# Altium schematic sheet [4] Sensors.SchDoc: =DocumentName
size A3; Organization: ORGANIZATION; Address1: R. Aprígio Veloso, 882, Universitário; Address2: Campina Grande - PB; Address3: 58429-900; DocumentNumber: 4; Revision: -; SheetNumber: 4; SheetTotal: 9; ENG_DATE: --/--/--; DSN_DATE: --/--/--; CHK_DATE: --/--/--; SCH_SCALE: 1:1
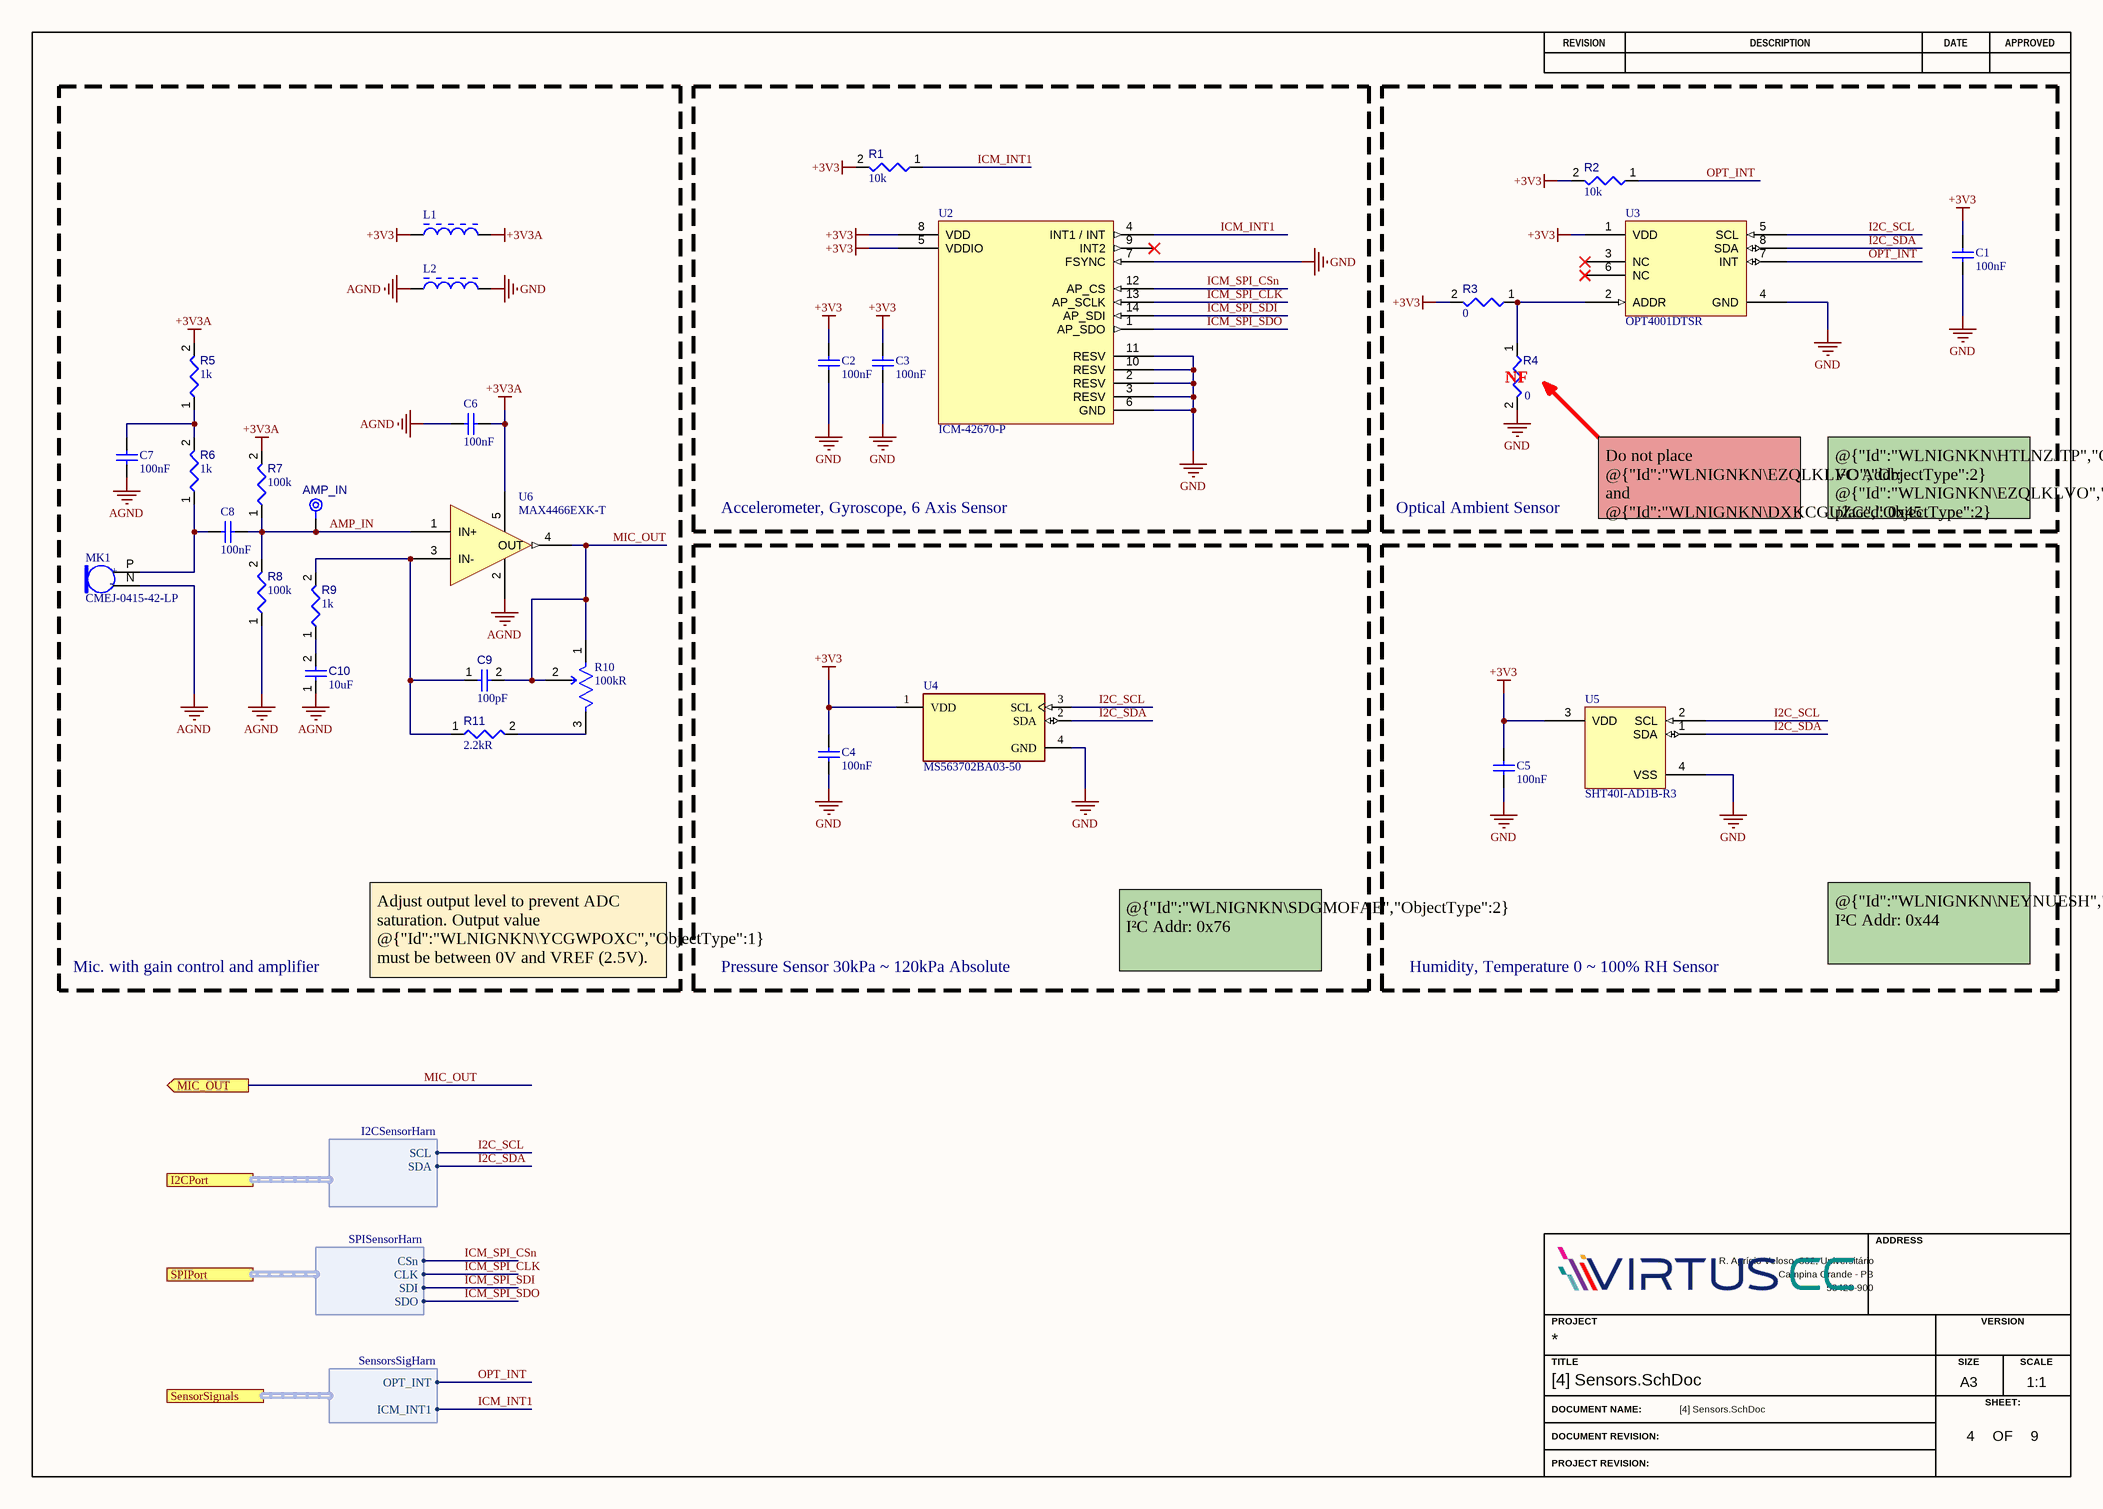
[diagram p0: [4] Sensors.SchDoc]

## Parts
AMP_IN  TPAD6R  [TP06R]  (value not drawn)  (no BOM)
C1  value 100nF  [CAPC0603(1608)100_L]  (hidden comment: VJ0603Y104MXJCW1BC)
C2  value 100nF  [CAPC0603(1608)100_L]  (hidden comment: VJ0603Y104MXJCW1BC)
C3  value 100nF  [CAPC0603(1608)100_L]  (hidden comment: VJ0603Y104MXJCW1BC)
C4  value 100nF  [CAPC0603(1608)100_L]  (hidden comment: VJ0603Y104MXJCW1BC)
C5  value 100nF  [CAPC0603(1608)100_L]  (hidden comment: VJ0603Y104MXJCW1BC)
C6  value 100nF  [CAPC0603(1608)100_L]  (hidden comment: VJ0603Y104MXJCW1BC)
C7  value 100nF  [CAPC0603(1608)100_L]  (hidden comment: VJ0603Y104MXJCW1BC)
C8  value 100nF  [CAPC0603(1608)100_L]  (hidden comment: VJ0603Y104MXJCW1BC)
C9  value 100pF  [CAPC0603(1608)100_L]  (hidden comment: C0603C101K5GACTU)
C10  value 10uF  [CAPC0603(1608)100_L]  (hidden comment: GRM188R60J106ME47D)
L1  BLM21PG331SN1D  [INDC2013X105X50ML20T20]  (value not drawn)
L2  BLM21PG331SN1D  [INDC2013X105X50ML20T20]  (value not drawn)
MK1  CMEJ-0415-42-LP  [MIC_CMEJ-0415-42-LP]
R1  value 10k  [RESC0603(1608)_L]  (hidden comment: Resistor 10k +/-1% 0603 100 mW)
R2  value 10k  [RESC0603(1608)_L]  (hidden comment: Resistor 10k +/-1% 0603 100 mW)
R3  value 0  [RESC0603(1608)_L]  (hidden comment: Resistor 0R +/- 5% 0603 100 mW)
R4  value 0  [RESC0603(1608)_L]  (hidden comment: Resistor 0R +/- 5% 0603 100 mW)
R5  value 1k  [RESC0603(1608)_L]  (hidden comment: Resistor 1k +/-1% 0603 100 mW)
R6  value 1k  [RESC0603(1608)_L]  (hidden comment: Resistor 1k +/-1% 0603 100 mW)
R7  value 100k  [RESC0603(1608)_L]  (hidden comment: Resistor 100k +/-1% 0603 100 mW)
R8  value 100k  [RESC0603(1608)_L]  (hidden comment: Resistor 100k +/-1% 0603 100 mW)
R9  value 1k  [RESC0603(1608)_L]  (hidden comment: Resistor 1k +/-1% 0603 100 mW)
R10  value 100kR  [FP-TC33X-2-MFG]  (hidden comment: TC33X-2-104E)
R11  value 2.2kR  [RESC0603(1608)_L]  (hidden comment: CRCW06032K20FKEA)
U2  ICM-42670-P  [QFN50P300X250X81-14N]
U3  OPT4001DTSR  [SON50P130X60-8N]
U4  MS563702BA03-50  [FP-MS563702BA03-50-MFG]
U5  SHT40I-AD1B-R3  [QFN80P150X150X55-4N]
U6  MAX4466EXK-T  [SOT65P200X110-5N]

## Blocks framed on the sheet
Mic. with gain control and amplifier: AMP_IN C6-C10 L1 L2 MK1 R5-R11 U6
Accelerometer, Gyroscope, 6 Axis Sensor: C2 C3 R1 U2
Pressure Sensor 30kPa ~ 120kPa Absolute: C4 U4
Humidity, Temperature 0 ~ 100% RH Sensor: C5 U5

## Ports
I2CPort (harness I2CSensorHarn, see [3] TopLevel[7A]), MIC_OUT (out, see [3] TopLevel[7B]), SensorSignals (harness SensorsSigHarn, see [3] TopLevel[6A]), SPIPort (harness SPISensorHarn, see [3] TopLevel[6B])

## Harnesses
I2CSensorHarn: SCL, SDA
SPISensorHarn: CSn, CLK, SDI, SDO
SensorsSigHarn: OPT_INT, ICM_INT1

## Nets
+3V3: C1.1 C2.1 C3.1 C4.2 C5.2 L1.1 R1.2 R2.2 R3.2 U2.5(VDDIO) U2.8(VDD) U3.1(VDD) U4.1(VDD) U5.3(VDD)
+3V3A: C6.2 L1.2 R5.2 R7.2 U6.5(VCC)
AGND: C6.1 C7.1 C10.1 L2.1 MK1.N(GND) R8.1 U6.2(GND)
GND: C1.2 C2.2 C3.2 C4.1 C5.1 L2.2 R4.2 U2.2(RESV) U2.3(RESV) U2.6(GND) U2.7(FSYNC) U2.10(RESV) U2.11(RESV) U3.4(GND) U4.4(GND) U5.4(VSS)
AMP_IN: AMP_IN.1(TP) C8.2 R7.1 R8.2 U6.1(IN+)
I2C_SCL: U3.5(SCL) U4.3(SCL) U5.2(SCL) ; port I2CPort.SCL
I2C_SDA: U3.8(SDA) U4.2(SDA) U5.1(SDA) ; port I2CPort.SDA
ICM_INT1: R1.1 U2.4(INT1_/_INT) ; port SensorSignals.ICM_INT1
ICM_SPI_CLK: U2.13(AP_SCLK) ; port SPIPort.CLK
ICM_SPI_CSn: U2.12(AP_CS) ; port SPIPort.CSn
ICM_SPI_SDI: U2.14(AP_SDI) ; port SPIPort.SDI
ICM_SPI_SDO: U2.1(AP_SDO) ; port SPIPort.SDO
MIC_OUT: C9.2 R10.1(CCW) R10.2(WIPER) U6.4(OUT) ; port MIC_OUT
OPT_INT: R2.1 U3.7(INT) ; port SensorSignals.OPT_INT
NetC7_2: C7.2 R5.1 R6.2
NetC8_1: C8.1 MK1.P(OUTPUT) R6.1
NetC9_1: C9.1 R9.2 R11.1 U6.3(IN-)
NetC10_2: C10.2 R9.1
NetR3_1: R3.1 R4.1 U3.2(ADDR)
NetR10_3: R10.3(CW) R11.2

Not connected (* = marked no-connect by the designer): U2 9(INT2)*; U3 3(NC)* 6(NC)*

## Notes on the sheet
- (near R4) NF
- Optical Ambient Sensor
- Do not place @{"Id":"WLNIGNKN\EZQLKLVO","ObjectType":2} and @{"Id":"WLNIGNKN\DXKCGUZG","ObjectType":2}  simultaneously
- @{"Id":"WLNIGNKN\HTLNZJTP","ObjectType":2} I²C Addr:
  @{"Id":"WLNIGNKN\EZQLKLVO","ObjectType":2} placed: 0x45
  @{"Id":"WLNIGNKN\DXKCGUZG","ObjectType":2} placed: 0x44
- Adjust output level to prevent ADC saturation. Output value @{"Id":"WLNIGNKN\YCGWPOXC","ObjectType":1} must be between 0V and VREF (2.5V).
- @{"Id":"WLNIGNKN\SDGMOFAE","ObjectType":2}  I²C Addr: 0x76
- @{"Id":"WLNIGNKN\NEYNUESH","ObjectType":2}  I²C Addr: 0x44
- REVISION
- DESCRIPTION
- DATE
- APPROVED
- ADDRESS
- PROJECT
- VERSION
- TITLE
- A3
- SIZE
- SCALE
- DOCUMENT NAME:
- DOCUMENT REVISION:
- OF
- SHEET:
- PROJECT REVISION:
- (in symbol CMP-010-000001-2) +; -

## Library data of the parts
AMP_IN = CMP-00028-00002-2: 0.6mm round; Pins: 1
C1-C8 = CMP-001-00085-1: Multilayer Ceramic Capacitor, 0.1 uF, 16 V, ± 20%, X7R, 0603 [1608 Metric]; Dielectric Material: Tantalum; Voltage Rating: 16V; Packaging: Tape and Reel; Min Operating Temperature: -55°C; Case/Package: 0603; Length: 1.6mm; Termination: SMD/SMT; Height: 0.95mm; Mounting Technology: Surface Mount; Width: 0.8mm; Case Code (Imperial): 0603; Construction: Flat; Lead Free: Lead Free; Package Quantity: 4000; Max Operating Temperature: 125°C; Dielectric: X7R; RoHS Compliant: Yes; Depth: 0.8mm; Tolerance: 20%; Series: VJ; Case Code (Metric): 1608; Voltage Rating (DC): 16V
C9 = CMP-001-00088-1: Multilayer Ceramic Capacitor, 100 pF, 50 V, ï¿½ 10%, C0G (NP0), 0603 [1608 Metric]; Dissipation Factor: 0.1%; Voltage Rating: 50V; Temperature Coefficient: 30ppm/°C; Min Operating Temperature: -55°C; Dielectric Material: Ceramic; Case/Package: 0603; Depth: 0.8mm; Mounting Technology: Surface Mount,PCB; Tolerance: 10%; Dielectric: C0G; Case Code (Metric): 1608; Height: 0.8mm; RoHS Compliant: Yes; Termination: SMD/SMT; Max Operating Temperature: 125°C; Length: 1.6mm; Packaging: Tape and Reel; Radiation Hardening: No; Voltage Rating (DC): 50V; Package Quantity: 1; Lead Free: Lead Free; Construction: Flat; Lead Pitch: 0.7mm; Series: C; Thickness: 0.034inch; Reach SVHC Compliant: No; Width: 0.031inch; Material: Ceramic; Case Code (Imperial): 0603
C10 = CMP-001-00087-1: Multilayer Ceramic Capacitor, 10 uF, 6.3 V, ± 20%, X5R, 0603 [1608 Metric]; Voltage Rating: 6.3V; Case/Package: 0603; Series: GRM; Mounting Technology: Surface Mount; RoHS Compliant: Yes; Package Quantity: 4000; Case Code (Metric): 1608; Dielectric: X5R; Weight: 0.000222oz; Max Operating Temperature: 85°C; Width: 0.8mm; Termination: Standard; Height: 0.8mm; Tolerance: 20%; Voltage Rating (DC): 6.3V; Length: 1.6mm; Min Operating Temperature: -55°C; Packaging: Cut Tape; Lead Free: Lead Free; Case Code (Imperial): 0603
L1 L2 = CMP-006-00000-4: IND, Chip Ferrite Bead, 330 Ohm, +/- 25%, 1.5 A, -55 to 125 degC, 0805 (2012 Metric), Tape and Reel; Manufacturer: Murata; Impedance: 330Ohm; Current Rating: 1.5A; Resistance: 90mohm; Min Operating Temperature: -55°C; Datasheet Version: Nov-11; Package Quantity: 4000; Datasheet URL: http://psearch.en.murata.com/inductor/product/LQG15HS15NJ02_.pdf; Core Material: Ferrite; Mounting Technology: SM; Package Reference: 0805; Max Current Rating: 1.5A; RoHS Compliant: True; Tolerance: 25%; Max Operating Temperature: 125°C; Package Description: 2-Pin Surface Mount Device, Body 2 x1.25 mm; Case/Package: 0805; Packaging: TapeandReel
MK1 = CMP-010-000001-2: 4.0 mm, Omnidirectional, PCB Mount, 2.0 Vdc, Elecret Condenser Microphone; Frequency: 100Hz; Shape: Circular; Operating Supply Current: 500uA; Voltage Rating: 2V; Output Type: Analog; Clock Frequency: 10kHz; MF: {'manufacturer': u'CUI'}; Value: *; Termination: PC Pins; Availability: Unavailable; Width: 4mm; Design Item ID: CMEJ-0415-42-LP; Series: CMEJ; Direction: Omnidirectional; Pin Count: 2; Price: None; Component Type: Standard; Package: None; MP: CMEJ-0415-42-LP; Operating Supply Voltage: 2V; Length: 4mm; Height: 1.5mm; Source: CMEJ-0415-42-LP.SchLib
R1 R2 = CMP-009-00017-7: Chip Resistor, 10 KOhm, +/- 1%, 01 W, -55 to 155 degC, 0603 (1608 Metric); Power: 100mW; Voltage Rating: 50V; Mounting Technology: SM; Max Operating Temperature: 155°C; Case/Package: 0603; Tolerance: 1%; RoHS Compliant: True; Pins: 2; Min Operating Temperature: -55°C
R3 R4 = CMP-009-00006-6: Chip Resistor, 0 Ohm, 0.1 W, -55 to 155 degC, 0603 (1608 Metric); Power: 100mW; Voltage Rating: 50V; Tolerance: 5%; Mounting Technology: SM; RoHS Compliant: True; Max Operating Temperature: 155°C; Min Operating Temperature: -55°C; Case/Package: 0603; Pins: 2
R5 R6 R9 = CMP-009-00014-6: Chip Resistor, 1 KOhm, +/-1%, 0.1 W, -55 to 155 degC, 0603 (1608 Metric); Power: 100mW; Tolerance: 1%; Voltage Rating: 50V; Mounting Technology: SM; Case/Package: 0603; Min Operating Temperature: -55°C; RoHS Compliant: True; Max Operating Temperature: 155°C; Pins: 2
R7 R8 = CMP-009-00023-6: Chip Resistor, 100 KOhm, +/- 1%, 0.1 W, -55 to 155 degC, 0603 (1608 Metric); Power: 100mW; Voltage Rating: 50V; Tolerance: 1%; RoHS Compliant: True; Pins: 2; Min Operating Temperature: -55°C; Case/Package: 0603; Max Operating Temperature: 155°C; Mounting Technology: SM
R10 = CMP-009-00187-1: Cermet trimmer potentiometer, 100 kΩ, 0.1 W, SMD, on top, TC33X-2-104E; Resistance Tolerance: 25%; Voltage Rating (DC): 50V; Power Rating: 100mW; Temperature Coefficient: 250ppm/°C; Number of Turns: 1; Mounting Technology: Surface Mount; Pins: 2; Resistor Type: Carbon,Cermet; Tolerance: 25%; Min Operating Temperature: -40°C; Radiation Hardening: No; Length: 0.15inch; Max Operating Temperature: 100°C; Height: 0.047inch; RoHS Compliant: Yes; Max Power Dissipation: 100mW; Depth: 3.8mm; Reach SVHC Compliant: No; Military Standard: Not; Series: TC33; Width: 0.118inch; Weight: 29.4mg; Termination: Foot Print; Package Quantity: 1; Packaging: Tape and Reel
R11 = CMP-009-00186-1: SMD Chip Resistor, 2.2 kOhm, ± 1%, 100 mW, 0603 [1608 Metric], Thick Film, General Purpose; Voltage Rating (DC): 75V; Max Power Dissipation: 100mW; Temperature Coefficient: 100ppm/°C; Depth: 0.85mm; Height: 0.45mm; Contact Plating: Tin; Resistance Tolerance: 1%; Ratings: AEC-Q200; Weight: 7.1E-05oz; Series: CRCW; Case Code (Imperial): 0603; Construction: Rectangular; Width: 0.033inch; Reach SVHC Compliant: Unknown; Case Code (Metric): 1608; Resistor Type: Thick Film; Packaging: Tape and Reel; Case/Package: 0603; Package Quantity: 10; RoHS Compliant: Yes; Lead Free: Lead Free; Military Standard: Not; Termination: SMD/SMT; Tolerance: 1%; Technology: THICK FILM; Max Operating Temperature: 155°C; Voltage Rating: 75V; Power Rating: 100mW; Length: 1.55mm; Number of Terminations: 2; Radiation Hardening: No; Min Operating Temperature: -55°C; Features: Automotive AEC-Q200
U2 = CMP-010-00032-3: Mems Module, 1.71-3.6 V, Lga-14 Rohs Compliant: Yes; Width: 3mm; Length: 2.5mm; Min Operating Temperature: -40°C
U3 = CMP-010-00031-2: High-speed high-precision digital ambient light sensor (ALS) 8-SOT-5X3 -40 to 85; Length: 2.1mm; Height: 600um; Width: 1.2mm; Thickness: 550um; Pins: 8
U4 = CMP-010-00027-2: Pressure Sensor, Barometric, 300 mbar, 1200 mbar, QFN, 8, -40 C; Min Supply Voltage: 1.8V; Max Supply Voltage: 3.6V; Supply Current: 20.09uA; Pins: 8; Packaging: Cut Tape; Min Operating Temperature: -40°C; Lead Free: Lead Free; RoHS Compliant: Yes; Height: 1mm; Max Operating Temperature: 85°C; Reach SVHC Compliant: No; Pressure Type: Barometric; Case/Package: QFN
U5 = CMP-010-00033-3: Humidity And Temperature Sensor
U6 = CMP-00027-00002-4: Audio Amp Microphone 1-CH Mono Class-AB 5-Pin SC-70 T/R; Max Supply Voltage: 5.5V; Min Supply Voltage: 2.4V; Gain Bandwidth Product: 600kHz; Power Supply Rejection Ratio (PSRR): 112dB; RoHS Compliant: No; Radiation Hardening: No; Series: -; Packaging: Tape and Reel; Mounting Technology: Surface Mount; Max Operating Temperature: 85°C; Min Operating Temperature: -40°C